# Altium schematic sheet BoardB-Connectors.SchDoc
size A; SheetNumber: 1; SheetTotal: 3
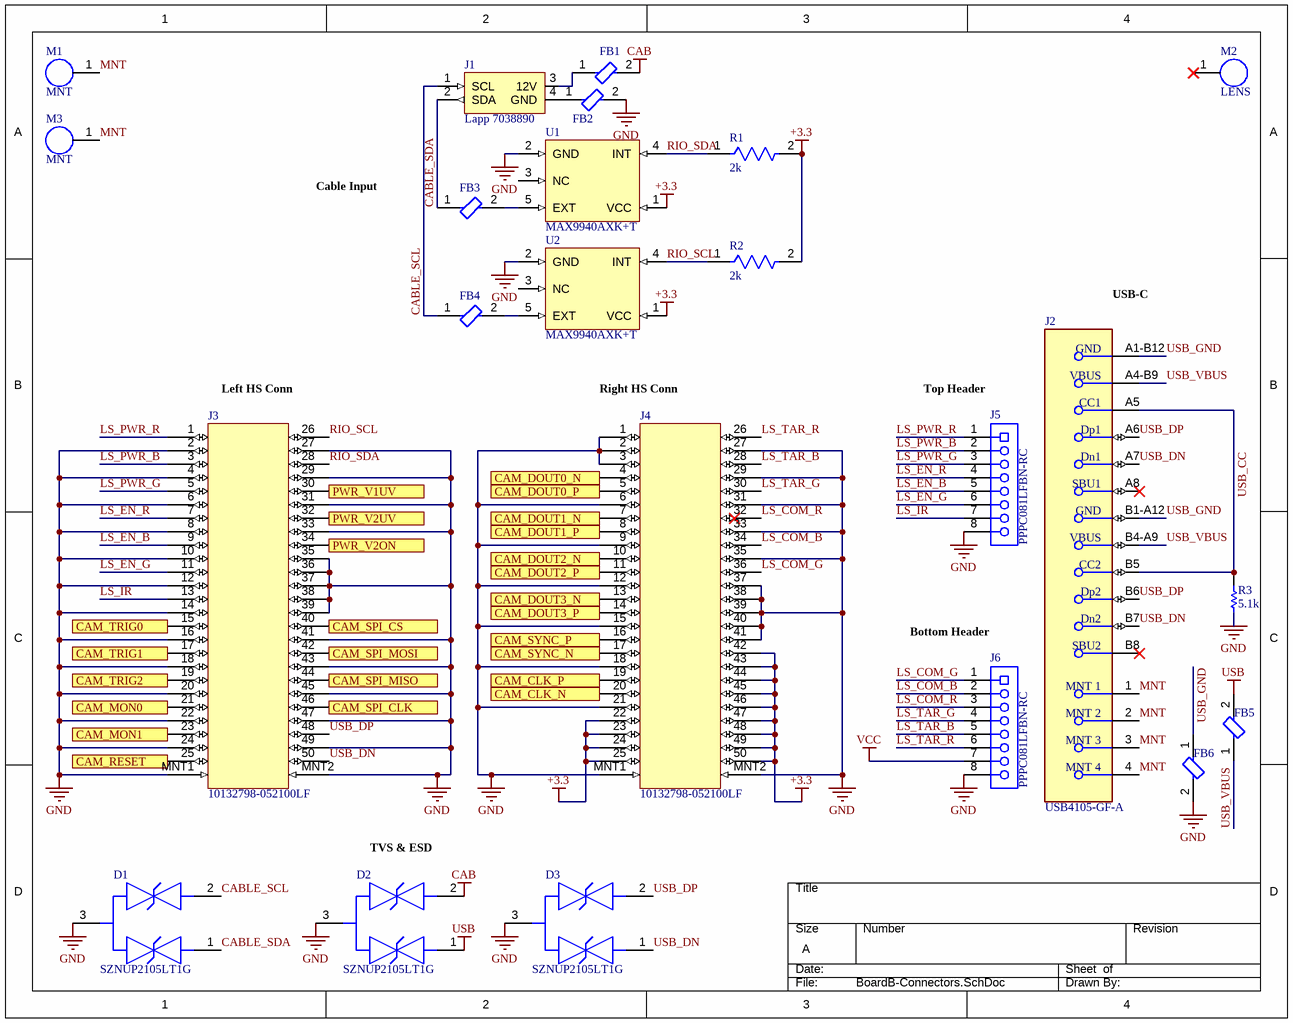
[diagram p0: BoardB-Connectors.SchDoc]

## Parts
D1  SZNUP2105LT1G  [FP-318-08-MFG]
D2  SZNUP2105LT1G  [FP-318-08-MFG]
D3  SZNUP2105LT1G  [FP-318-08-MFG]
FB1  BLM18SG221TN1D  [FP-BLM18-0_15-t0_5-IPC_A]  (value not drawn)
FB2  BLM18SG221TN1D  [FP-BLM18-0_15-t0_5-IPC_A]  (value not drawn)
FB3  BLM18SG221TN1D  [FP-BLM18-0_15-t0_5-IPC_A]  (value not drawn)
FB4  BLM18SG221TN1D  [FP-BLM18-0_15-t0_5-IPC_A]  (value not drawn)
FB5  BLM18SG221TN1D  [FP-BLM18-0_15-t0_5-IPC_A]  (value not drawn)
FB6  BLM18SG221TN1D  [FP-BLM18-0_15-t0_5-IPC_A]  (value not drawn)
J1  Lapp 7038890  [Lapp 7038890]
J2  USB4105-GF-A  [FP-USB4105-GF-A-MFG]
J3  10132798-052100LF  [10132798-052100LF]
J4  10132798-052100LF  [10132798-052100LF]
J5  PPPC081LFBN-RC  [SLIN-PPPC081LFBN-RC_V]
J6  PPPC081LFBN-RC  [SLIN-PPPC081LFBN-RC_V]
M1  MNT  [MNT]
M2  LENS  [LENS_MNT]
M3  MNT  [MNT]
R1  2k  [FP-RC_L0402-MFG]
R2  2k  [FP-RC_L0402-MFG]
R3  5.1k  [RESC0201(0603)_L]
U1  MAX9940AXK+T  [MAX9940AXK+T]
U2  MAX9940AXK+T  [MAX9940AXK+T]

## Ports
CAM_CLK_N (out), CAM_CLK_P (out), CAM_DOUT0_N (in), CAM_DOUT0_P (in), CAM_DOUT1_N (in), CAM_DOUT1_P (in), CAM_DOUT2_N (in), CAM_DOUT2_P (in), CAM_DOUT3_N (in), CAM_DOUT3_P (in), CAM_MON0 (in), CAM_MON1 (in), CAM_RESET (out), CAM_SPI_CLK (out), CAM_SPI_CS (out), CAM_SPI_MISO (in), CAM_SPI_MOSI (out), CAM_SYNC_N (in), CAM_SYNC_P (in), CAM_TRIG0 (out), CAM_TRIG1 (out), CAM_TRIG2 (out), PWR_V1UV (in), PWR_V2ON (in), PWR_V2UV (in)

## Nets
+3.3: J4.22 J4.23 J4.24 J4.25 J4.42 J4.43 J4.44 J4.45 J4.46 J4.47 J4.48 J4.49 J4.50 R1.2 R2.2 U1.1(VCC) U2.1(VCC)
CAB: D2.2 FB1.2
GND: D1.3 D2.3 D3.3 FB2.2 FB6.2 J3.2 J3.4 J3.6 J3.8 J3.10 J3.12 J3.14 J3.16 J3.18 J3.20 J3.22 J3.24 J3.27 J3.29 J3.31 J3.33 J3.35 J3.36 J3.37 J3.38 J3.39 J3.41 J3.43 J3.45 J3.47 J3.49 J3.MNT1 J3.MNT2 J4.1 J4.2 J4.3 J4.6 J4.9 J4.12 J4.15 J4.18 J4.21 J4.27 J4.29 J4.31 J4.33 J4.35 J4.37 J4.38 J4.39 J4.40 J4.41 J4.MNT1 J4.MNT2 J5.8 J6.8 R3.1 U1.2(GND) U2.2(GND)
USB: D2.1 FB5.2
VCC: J6.7
CABLE_SCL: D1.2 FB4.1 J1.1(SCL)
CABLE_SDA: D1.1 FB3.1 J1.2(SDA)
CAM_CLK_N: J4.20 ; port CAM_CLK_N
CAM_CLK_P: J4.19 ; port CAM_CLK_P
CAM_DOUT0_N: J4.4 ; port CAM_DOUT0_N
CAM_DOUT0_P: J4.5 ; port CAM_DOUT0_P
CAM_DOUT1_N: J4.7 ; port CAM_DOUT1_N
CAM_DOUT1_P: J4.8 ; port CAM_DOUT1_P
CAM_DOUT2_N: J4.10 ; port CAM_DOUT2_N
CAM_DOUT2_P: J4.11 ; port CAM_DOUT2_P
CAM_DOUT3_N: J4.13 ; port CAM_DOUT3_N
CAM_DOUT3_P: J4.14 ; port CAM_DOUT3_P
CAM_MON0: J3.21 ; port CAM_MON0
CAM_MON1: J3.23 ; port CAM_MON1
CAM_RESET: J3.25 ; port CAM_RESET
CAM_SPI_CLK: J3.46 ; port CAM_SPI_CLK
CAM_SPI_CS: J3.40 ; port CAM_SPI_CS
CAM_SPI_MISO: J3.44 ; port CAM_SPI_MISO
CAM_SPI_MOSI: J3.42 ; port CAM_SPI_MOSI
CAM_SYNC_N: J4.17 ; port CAM_SYNC_N
CAM_SYNC_P: J4.16 ; port CAM_SYNC_P
CAM_TRIG0: J3.15 ; port CAM_TRIG0
CAM_TRIG1: J3.17 ; port CAM_TRIG1
CAM_TRIG2: J3.19 ; port CAM_TRIG2
LS_COM_B: J4.34 J6.2
LS_COM_G: J4.36 J6.1
LS_COM_R: J4.32 J6.3
LS_EN_B: J3.9 J5.5
LS_EN_G: J3.11 J5.6
LS_EN_R: J3.7 J5.4
LS_IR: J3.13 J5.7
LS_PWR_B: J3.3 J5.2
LS_PWR_G: J3.5 J5.3
LS_PWR_R: J3.1 J5.1
LS_TAR_B: J4.28 J6.5
LS_TAR_G: J4.30 J6.4
LS_TAR_R: J4.26 J6.6
MNT: J2.1(MNT_1) J2.2(MNT_2) J2.3(MNT_3) J2.4(MNT_4) M1.1 M3.1
PWR_V1UV: J3.30 ; port PWR_V1UV
PWR_V2ON: J3.34 ; port PWR_V2ON
PWR_V2UV: J3.32 ; port PWR_V2UV
RIO_SCL: J3.26 R2.1 U2.4(INT)
RIO_SDA: J3.28 R1.1 U1.4(INT)
USB_CC: J2.A5(CC1) J2.B5(CC2) R3.2
USB_DN: D3.1 J2.A7(Dn1) J2.B7(Dn2) J3.50
USB_DP: D3.2 J2.A6(Dp1) J2.B6(Dp2) J3.48
USB_GND: FB6.1 J2.A1-B12(GND) J2.B1-A12(GND)
USB_VBUS: FB5.1 J2.A4-B9(VBUS) J2.B4-A9(VBUS)
NetFB1_1: FB1.1 J1.3(12V)
NetFB2_1: FB2.1 J1.4(GND)
NetFB3_2: FB3.2 U1.5(EXT)
NetFB4_2: FB4.2 U2.5(EXT)

Not connected (* = marked no-connect by the designer): J2 A8(SBU1)* B8(SBU2)*; M2 1*; U1 3(NC); U2 3(NC)

## Notes on the sheet
- Cable Input
- USB-C
- (near J3) Left HS Conn
- (near J4) Right HS Conn
- (near J5) Top Header
- (near J6) Bottom Header
- (near D2) TVS & ESD

## Library data of the parts
D1-D3 = CMP-1063-00167-2: TVS DIODE 24V 44V SOT23-3; Manufacturer: ON Semiconductor; Capacitance: 30pF; Max Junction Temp: +150°C; Breakdown Voltage: 26.2V; Number Of Channels: 2; Automotive Grade: Grade 0; Standoff Height: 0.01mm; Peak Pulse Current: 8A; Value: 30pF; Direction: Bidirectional; Peak Pulse Power: 350W; Octopart: https://octopart.com/sznup2105lt1g-on+semiconductor-22134626; Reverse Standoff Voltage: 24V; Digikey Description: TVS DIODE 24V 44V SOT23-3; RoHS: TRUE; Manufacturer Part Number: SZNUP2105LT1G; Height: 1.11mm; Automotive: Yes; ComponentLink2URL: https://www.onsemi.com/pub/Collateral/NUP2105L-D.PDF; Device Class L3: unset; Package: 318-08; Lead Free: Yes; Device Class L2: TVS Diodes; Footprint Url: https://www.onsemi.com/pub/Collateral/318-08.PDF; Temperature Range Low: -55°C; Device Class L1: Circuit Protection; Temperature: -55°C to +150°C; Temperature Range High: +150°C; Category: Diode; Clamping Voltage: 44V; ComponentLink2Description: Datasheet
FB1-FB6 = CMP-0686-00596-3: Chip Ferrite Bead, 0603, 220Ω @ 100MHz, 25%, 0.04Ω, 2.5A; Impedance: 220R; DC Resistance-Max: 40mR; Number of Circuits: 1; Test Frequency: 100MHz; Material: Ferrite; Lead Free: Lead Free; Width: 0.8mm; Max Current Rating: 2.5A; Termination: SMD/SMT; Depth: 0.95mm; Packaging: Tape and Reel; Case Code (Metric): 1608; DC Current: 2.5A; Weight: 7.1E-05oz; Min Operating Temperature: -55°C; DC Resistance (DCR): 40mR; Max Operating Temperature: 125°C; Core Material: Ferrite; Max DC Current: 2.5A; Case/Package: 0603; REACH SVHC: No SVHC; Height: 0.8mm; Number of Pins: 2; Tolerance: 25%; RoHS Compliant: Yes; Radiation Hardening: No; Current Rating: 2.5A; Number of Lines: 1; Series: BLM18S; Case Code (Imperial): 0603; Length: 1.6mm; Package Quantity: 1
J2 = CMP-245163-000001-1: CONN RCPT USB2.0 TYPEC 5A; Manufacturer: GCT; Voltage Rating: 20V; Is Female: yes; Current Rating: 5/6.25/1.25/0.25A; Number Of Contacts: 16; Conn Orientation: Right Angle; Device Class L1: Connectors; Category: Conn; Lead Free: Yes; RoHS: TRUE; Temperature Range High: +85°C; Digikey Description: CONN RCPT USB2.0 TYPEC 5A; Device Class L3: unset; ComponentLink2Description: Datasheet; Manufacturer Part Number: USB4105-GF-A; Package: 0; Usb Standard: USB 2.0; Device Class L2: USB Connectors; Automotive: No; Temperature Range Low: -40°C; Height: 3.46mm; Temperature: -40°C to +85°C; Contact Material: Gold,Nickel; ComponentLink2URL: https://gct.co/files/drawings/usb4105.pdf; Octopart: https://octopart.com/usb4105-gf-a-gct-106627878
J3 J4 = 10132798-052100LF: 50POSITIONING, 2.7MM HEIGHT RECE; Connector Type: Receptacle; Number of Positions: 50; Pitch: 0.02inch; Mated Stacking Heights: 6mm; InternalPart#: 10132798-052100LF; Supplier 1: Digi-Key; RoHS: Yes; Stock 1: 694; Pricing 1: 1=1.45000, 10=1.27200, 100=1.09740, 500=0.89792 (USD); Mount: Surface Mount; Contact Plating: Gold; Packaging: Tape and Reel; Number of Rows: 2; ComponentLink1URL: https://cdn.amphenol-icc.com/media/wysiwyg/files/drawing/10132798.pdf?src-supplier=Digi-Key; ComponentLink1Description: https://cdn.amphenol-icc.com/media/wysiwyg/files/drawing/10132798.pdf?src-supplier=Digi-Key; ComponentLink2URL: http://portal.fciconnect.com/Comergent//fci/drawing/10132798.pdf?src-supplier=Digi-Key; ComponentLink2Description: http://portal.fciconnect.com/Comergent//fci/drawing/10132798.pdf?src-supplier=Digi-Key
J5 J6 = CMP-1770-00002-1: Female Header, Pitch 2.54 mm, 1 x 8 Position, Height 8.5 mm, Tail Length 3.2 mm, -40 to 105 degC, RoHS, Bulk; Case\Package: TO-252-3; Rds On Max: 115 mohm; Typical Rise Time: 90 ns; Max Power Dissipation: 2.5 W; Input Capacitance: 350 pF; Elements: 1; Height: 2.39 mm; Min Operating Temperature: -55 degC; RoHSCompliant: true; PackageDescription: Female Header, Pitch 2.54 mm, 1 x 8 Position, Height 8.5 mm, Tail Length 3.2 mm; Length: 6.73 mm; ComponentLink1Description: Datasheet; Package Quantity: 2500; Max Operating Temperature: 150 degC; Width: 6.22 mm; Radiation Hardening: No; Packaging: Tape and Reel; REACH SVHC: No SVHC; Pins: 3; PackageReference: PPPC081LFBN-RC; ComponentLink1URL: http://sullinscorp.com/catalogs/101_PAGE114-115_.100_FEMALE_HDR.pdf; DatasheetVersion: Jan-15; Mount: Surface Mount
M2 = LENS_MNT
R1 R2 = CMP-2002-07580-2: RES SMD 2K OHM 1% 1/16W 0402; Manufacturer: Yageo; Manufacturer Part Number: RC0402FR-072KL; Voltage Rating: 50V; Temperature Coefficient: 100ppm/°C; Resistance: 2kΩ; Power Rating: 0.0625W; Standoff Height: 0mm; Value: 2kΩ; Category: Res; Device Class L3: Chip SMD Resistors; Octopart: https://octopart.com/rc0402fr-072kl-yageo-5032519; Mouser Description: RES SMD 2K OHM 1% 1/16W 0402; RoHS: TRUE; Temperature: -55°C to +155°C; Device Class L2: Resistors; Series: RC_L; Automotive: No; Temperature Range Low: -55°C; Footprint Url: https://www.yageo.com/upload/website/yageo_PYu-R_Mount_10_19050818_343.pdf; Height: 0.4mm; ComponentLink2Description: Datasheet; Package: RC_L0402; ComponentLink2URL: http://www.yageo.com/documents/recent/PYu-RC_Group_51_RoHS_L_9.pdf; Temperature Range High: +155°C; Lead Free: Yes; Device Class L1: Passive Components; Ipc Land Pattern Name: RESC10050X35; Composition: Thick Film; Digikey Description: RES SMD 2K OHM 1% 1/16W 0402; Tolerance: 1%
R3 = CMP-1010-00091-1: 5K1 0.05W 5% 0201 (0603 Metric)  SMD; Case-Metric: 0603; Value: 5100.00 Ohm; Case-EIA: 0201; Power: 0.05 W; Technology: SMT; Tolerance: 5 %